# EAGLE design G1000 Arduino Breakout and MCPs (EAGLE 9.6.2)
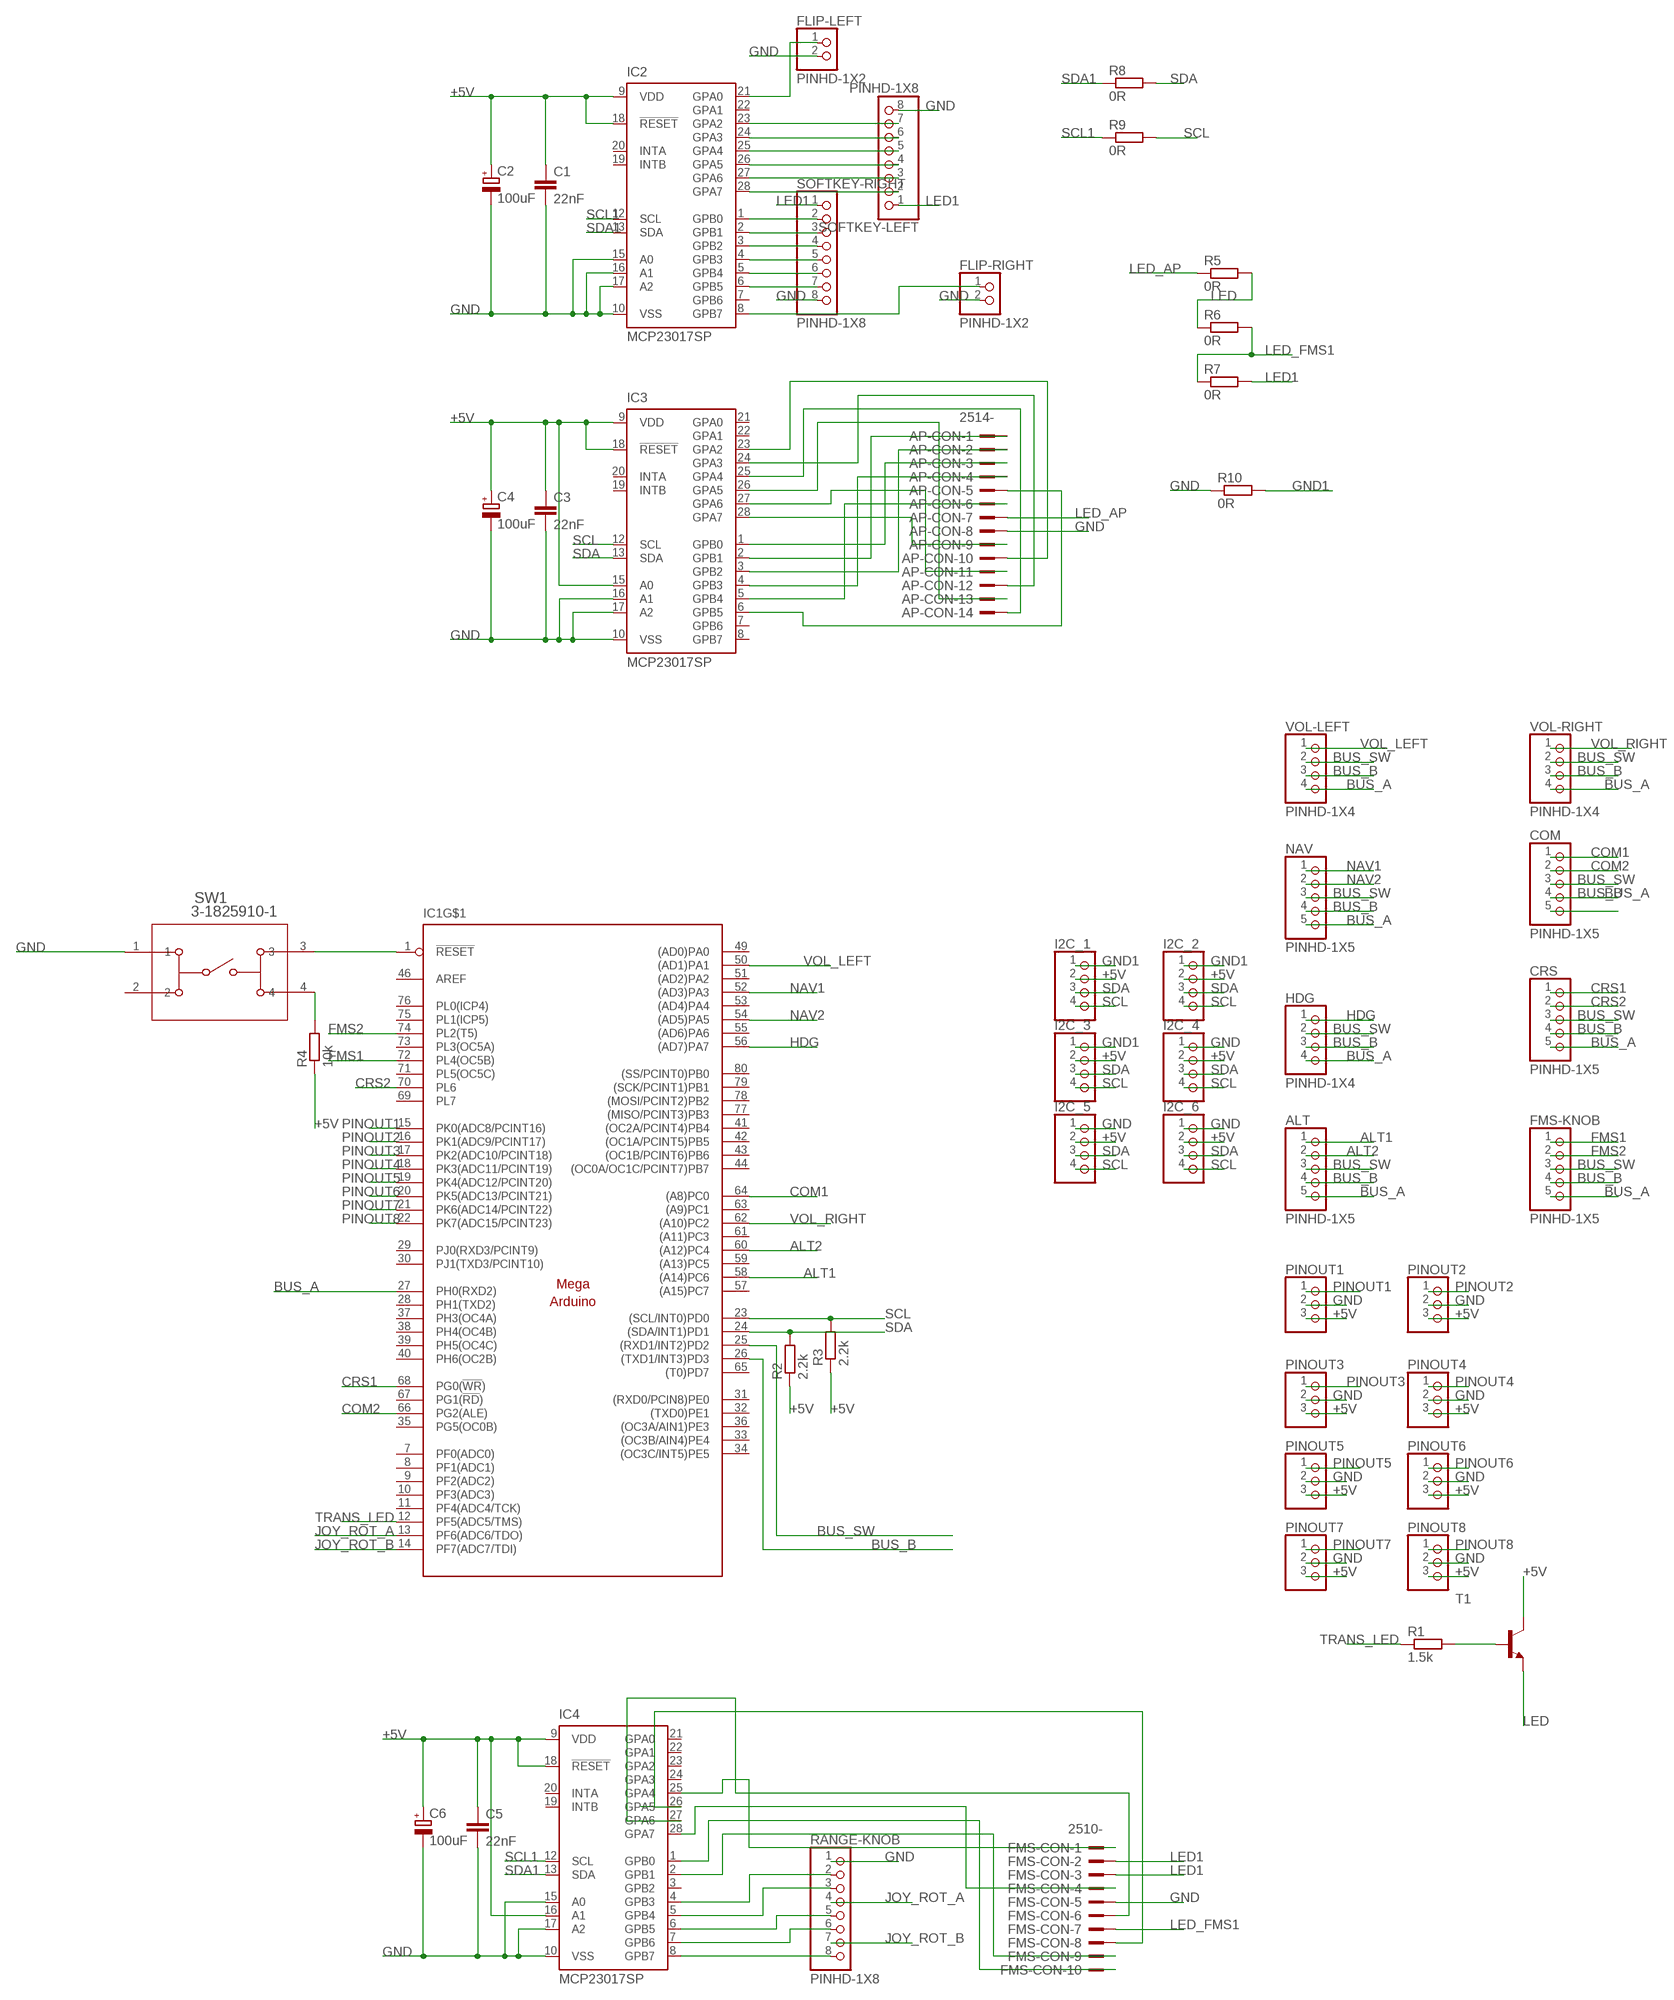
[diagram p0: schematic, sheet 1]

## Parts
ALT  PINHD-1X5  [1X05]
AP-CON  2514-  [PAK100/2500-14]
C1  22nF  C-EU025-025X050  [C025-025X050]
C2  100uF  CPOL-EUE2.5-6  [E2,5-6]
C3  22nF  C-EU025-025X050  [C025-025X050]
C4  100uF  CPOL-EUE2.5-6  [E2,5-6]
C5  22nF  C-EU025-025X050  [C025-025X050]
C6  100uF  CPOL-EUE2.5-6  [E2,5-6]
COM  PINHD-1X5  [1X05]
CRS  PINHD-1X5  [1X05]
FLIP-LEFT  PINHD-1X2  [1X02]
FLIP-RIGHT  PINHD-1X2  [1X02]
FMS-CON  2510-  [PAK100/2500-10]
FMS-KNOB  PINHD-1X5  [1X05]
HDG  PINHD-1X4  [1X04]
I2C_1  PINHD-1X4  [1X04]
I2C_2  PINHD-1X4  [1X04]
I2C_3  PINHD-1X4  [1X04]
I2C_4  PINHD-1X4  [1X04]
I2C_5  PINHD-1X4  [1X04]
I2C_6  PINHD-1X4  [1X04]
IC1  MEGAARDUINO_22  [MEGA_ARDUINO_2]
IC2  MCP23017SP  [DIL28-3]
IC3  MCP23017SP  [DIL28-3]
IC4  MCP23017SP  [DIL28-3]
NAV  PINHD-1X5  [1X05]
PINOUT1  PINHD-1X3  [1X03]
PINOUT2  PINHD-1X3  [1X03]
PINOUT3  PINHD-1X3  [1X03]
PINOUT4  PINHD-1X3  [1X03]
PINOUT5  PINHD-1X3  [1X03]
PINOUT6  PINHD-1X3  [1X03]
PINOUT7  PINHD-1X3  [1X03]
PINOUT8  PINHD-1X3  [1X03]
R1  1.5k  R-EU_0207/10  [0207/10]
R2  2.2k  R-EU_0207/10  [0207/10]
R3  2.2k  R-EU_0207/10  [0207/10]
R4  10k  R-EU_0207/10  [0207/10]
R5  0R  R-EU_0207/10  [0207/10]
R6  0R  R-EU_0207/10  [0207/10]
R7  0R  R-EU_0207/10  [0207/10]
R8  0R  R-EU_0207/10  [0207/10]
R9  0R  R-EU_0207/10  [0207/10]
R10  0R  R-EU_0207/10  [0207/10]
RANGE-KNOB  PINHD-1X8  [1X08]
SOFTKEY-LEFT  PINHD-1X8  [1X08]
SOFTKEY-RIGHT  PINHD-1X8  [1X08]
SW1  3-1825910-1  [SW4_1825910-H]
T1  2N2222-NPN-TO92-EBC  [TO92-EBC]
VOL-LEFT  PINHD-1X4  [1X04]
VOL-RIGHT  PINHD-1X4  [1X04]

## Nets
+5V: C1.1 C2.+ C3.1 C4.+ C5.1 C6.+ I2C_1.2 I2C_2.2 I2C_3.2 I2C_4.2 I2C_5.2 I2C_6.2 IC2.9(VDD) IC2.18(!RESET) IC3.9(VDD) IC3.15(A0) IC3.18(!RESET) IC4.9(VDD) IC4.16(A1) IC4.18(!RESET) PINOUT1.3 PINOUT2.3 PINOUT3.3 PINOUT4.3 PINOUT5.3 PINOUT6.3 PINOUT7.3 PINOUT8.3 R2.1 R3.1 R4.1 T1.C
ALT1: ALT.1 IC1.58((A14)PC6)
ALT2: ALT.2 IC1.60((A12)PC4)
BUS_A: ALT.5 COM.5 CRS.5 FMS-KNOB.5 HDG.4 IC1.27(PH0(RXD2)) NAV.5 VOL-LEFT.4 VOL-RIGHT.4
BUS_B: ALT.4 COM.4 CRS.4 FMS-KNOB.4 HDG.3 IC1.26((TXD1/INT3)PD3) NAV.4 VOL-LEFT.3 VOL-RIGHT.3
BUS_SW: ALT.3 COM.3 CRS.3 FMS-KNOB.3 HDG.2 IC1.25((RXD1/INT2)PD2) NAV.3 VOL-LEFT.2 VOL-RIGHT.2
COM1: COM.1 IC1.64((A8)PC0)
COM2: COM.2 IC1.66(PG2(ALE))
CRS1: CRS.1 IC1.68(PG0(!WR!))
CRS2: CRS.2 IC1.70(PL6)
FMS1: FMS-KNOB.1 IC1.72(PL4(OC5B))
FMS2: FMS-KNOB.2 IC1.74(PL2(T5))
GND: AP-CON.8 C1.2 C2.- C3.2 C4.- C5.2 C6.- FLIP-LEFT.2 FLIP-RIGHT.2 FMS-CON.5 I2C_4.1 I2C_5.1 I2C_6.1 IC2.10(VSS) IC2.15(A0) IC2.16(A1) IC2.17(A2) IC3.10(VSS) IC3.16(A1) IC3.17(A2) IC4.10(VSS) IC4.15(A0) IC4.17(A2) PINOUT1.2 PINOUT2.2 PINOUT3.2 PINOUT4.2 PINOUT5.2 PINOUT6.2 PINOUT7.2 PINOUT8.2 R10.1 RANGE-KNOB.1 SOFTKEY-LEFT.8 SOFTKEY-RIGHT.8 SW1.1
GND1: I2C_1.1 I2C_2.1 I2C_3.1 R10.2
HDG: HDG.1 IC1.56((AD7)PA7)
JOY_ROT_A: IC1.13(PF6(ADC6/TDO)) RANGE-KNOB.4
JOY_ROT_B: IC1.14(PF7(ADC7/TDI)) RANGE-KNOB.7
LED: R5.2 R6.1 T1.E
LED1: FMS-CON.2 FMS-CON.3 R7.2 SOFTKEY-LEFT.1 SOFTKEY-RIGHT.1
LED_AP: AP-CON.7 R5.1
LED_FMS1: FMS-CON.7 R6.2 R7.1
N$1: R1.2 T1.B
N$3: IC2.1(GPB0) SOFTKEY-RIGHT.2
N$4: IC2.2(GPB1) SOFTKEY-RIGHT.3
N$5: IC2.3(GPB2) SOFTKEY-RIGHT.4
N$6: IC2.4(GPB3) SOFTKEY-RIGHT.5
N$7: IC2.5(GPB4) SOFTKEY-RIGHT.6
N$8: IC2.6(GPB5) SOFTKEY-RIGHT.7
N$9: IC2.28(GPA7) SOFTKEY-LEFT.2
N$10: IC2.27(GPA6) SOFTKEY-LEFT.3
N$11: IC2.26(GPA5) SOFTKEY-LEFT.4
N$12: IC2.25(GPA4) SOFTKEY-LEFT.5
N$13: IC2.24(GPA3) SOFTKEY-LEFT.6
N$14: IC2.23(GPA2) SOFTKEY-LEFT.7
N$15: FLIP-LEFT.1 IC2.21(GPA0)
N$16: FLIP-RIGHT.1 IC2.8(GPB7)
N$17: R4.2 SW1.4
N$18: AP-CON.3 IC3.1(GPB0)
N$19: IC1.1(!RESET) SW1.3
N$20: AP-CON.1 IC3.2(GPB1)
N$21: AP-CON.2 IC3.3(GPB2)
N$22: AP-CON.4 IC3.4(GPB3)
N$23: AP-CON.6 IC3.5(GPB4)
N$24: AP-CON.9 IC3.28(GPA7)
N$25: AP-CON.11 IC3.27(GPA6)
N$26: AP-CON.13 IC3.26(GPA5)
N$27: AP-CON.14 IC3.25(GPA4)
N$28: AP-CON.12 IC3.24(GPA3)
N$29: AP-CON.10 IC3.23(GPA2)
N$30: AP-CON.5 IC3.6(GPB5)
N$31: IC4.8(GPB7) RANGE-KNOB.8
N$32: IC4.7(GPB6) RANGE-KNOB.6
N$33: IC4.6(GPB5) RANGE-KNOB.5
N$34: IC4.5(GPB4) RANGE-KNOB.3
N$35: IC4.4(GPB3) RANGE-KNOB.2
N$36: FMS-CON.1 IC4.25(GPA4)
N$37: FMS-CON.9 IC4.2(GPB1)
N$38: FMS-CON.10 IC4.1(GPB0)
N$39: FMS-CON.4 IC4.28(GPA7)
N$40: FMS-CON.6 IC4.27(GPA6)
N$41: FMS-CON.8 IC4.26(GPA5)
NAV1: IC1.52((AD3)PA3) NAV.1
NAV2: IC1.54((AD5)PA5) NAV.2
PINOUT1: IC1.15(PK0(ADC8/PCINT16)) PINOUT1.1
PINOUT2: IC1.16(PK1(ADC9/PCINT17)) PINOUT2.1
PINOUT3: IC1.17(PK2(ADC10/PCINT18)) PINOUT3.1
PINOUT4: IC1.18(PK3(ADC11/PCINT19)) PINOUT4.1
PINOUT5: IC1.19(PK4(ADC12/PCINT20)) PINOUT5.1
PINOUT6: IC1.20(PK5(ADC13/PCINT21)) PINOUT6.1
PINOUT7: IC1.21(PK6(ADC14/PCINT22)) PINOUT7.1
PINOUT8: IC1.22(PK7(ADC15/PCINT23)) PINOUT8.1
SCL: I2C_1.4 I2C_2.4 I2C_3.4 I2C_4.4 I2C_5.4 I2C_6.4 IC1.23((SCL/INT0)PD0) IC3.12(SCL) R3.2 R9.2
SCL1: IC2.12(SCL) IC4.12(SCL) R9.1
SDA: I2C_1.3 I2C_2.3 I2C_3.3 I2C_4.3 I2C_5.3 I2C_6.3 IC1.24((SDA/INT1)PD1) IC3.13(SDA) R2.2 R8.2
SDA1: IC2.13(SDA) IC4.13(SDA) R8.1
TRANS_LED: IC1.12(PF5(ADC5/TMS)) R1.1
VOL_LEFT: IC1.50((AD1)PA1) VOL-LEFT.1
VOL_RIGHT: IC1.62((A10)PC2) VOL-RIGHT.1
Unconnected: IC1.7(PF0(ADC0)) IC1.8(PF1(ADC1)) IC1.9(PF2(ADC2)) IC1.10(PF3(ADC3)) IC1.11(PF4(ADC4/TCK)) IC1.28(PH1(TXD2)) IC1.29(PJ0(RXD3/PCINT9)) IC1.30(PJ1(TXD3/PCINT10)) IC1.31((RXD0/PCIN8)PE0) IC1.32((TXD0)PE1) IC1.33((OC3B/AIN4)PE4) IC1.34((OC3C/INT5)PE5) IC1.35(PG5(OC0B)) IC1.36((OC3A/AIN1)PE3) IC1.37(PH3(OC4A)) IC1.38(PH4(OC4B)) IC1.39(PH5(OC4C)) IC1.40(PH6(OC2B)) IC1.41((OC2A/PCINT4)PB4) IC1.42((OC1A/PCINT5)PB5) IC1.43((OC1B/PCINT6)PB6) IC1.44((OC0A/OC1C/PCINT7)PB7) IC1.46(AREF) IC1.49((AD0)PA0) IC1.51((AD2)PA2) IC1.53((AD4)PA4) IC1.55((AD6)PA6) IC1.57((A15)PC7) IC1.59((A13)PC5) IC1.61((A11)PC3) IC1.63((A9)PC1) IC1.65((T0)PD7) IC1.67(PG1(!RD!)) IC1.69(PL7) IC1.71(PL5(OC5C)) IC1.73(PL3(OC5A)) IC1.75(PL1(ICP5)) IC1.76(PL0(ICP4)) IC1.77((MISO/PCINT3)PB3) IC1.78((MOSI/PCINT2)PB2) IC1.79((SCK/PCINT1)PB1) IC1.80((SS/PCINT0)PB0) IC2.7(GPB6) IC2.19(INTB) IC2.20(INTA) IC2.22(GPA1) IC3.7(GPB6) IC3.8(GPB7) IC3.19(INTB) IC3.20(INTA) IC3.21(GPA0) IC3.22(GPA1) IC4.3(GPB2) IC4.19(INTB) IC4.20(INTA) IC4.21(GPA0) IC4.22(GPA1) IC4.23(GPA2) IC4.24(GPA3) SW1.2

## Power pins joined to a net without a drawn wire
+3V3: IC1.2(+3V3)
+5V: IC1.3(+5V) IC1.47(+5V) IC1.48(+5V)
+VIN: IC1.6(+VIN)
GND: IC1.4(GND) IC1.5(GND) IC1.45(GND) IC1.81(GND) IC1.82(GND)

## Library data of the parts
ALT COM CRS FMS-KNOB NAV = Connector:PINHD-1X5: PIN HEADER; CATEGORY: CONNECTOR; SUB-CATEGORY: PIN-HEADER
AP-CON = con-3m:2514-: 3M (TM) Pak 100 4-Wall Header Source: 3M; OC_FARNELL: unknown; OC_NEWARK: unknown
C1 C3 C5 = rcl:C-EU: CAPACITOR, European symbol; SPICEPREFIX: C
C2 C4 C6 = rcl:CPOL-EU: POLARIZED CAPACITOR, European symbol; SPICEPREFIX: C
FLIP-LEFT FLIP-RIGHT = Connector:PINHD-1X2: PIN HEADER; CATEGORY: CONNECTOR; SUB-CATEGORY: PIN-HEADER
FMS-CON = con-3m:2510-: 3M (TM) Pak 100 4-Wall Header Source: 3M; MF: 3M; MPN: 2510-6002UB; OC_FARNELL: 9838244; OC_NEWARK: 46F4725
HDG VOL-LEFT VOL-RIGHT = Connector:PINHD-1X4: PIN HEADER; CATEGORY: CONNECTOR; SUB-CATEGORY: PIN-HEADER
I2C_1-I2C_6 = pinhead:PINHD-1X4: PIN HEADER
IC1 = arduino-mod for mega:MEGAARDUINO_2: The Arduino Mega is a microcontroller board based on the ATmega1280. - 54 digital input/output pins (of which 14 can be used as PWM outputs) - 16 analog inputs - 4 UARTs (hardware serial ports) - 16 MHz crystal oscillator - USB connection - power jack - ICSP header - reset button It contains everything needed to support the microcontroller; simply connect it to a computer with a USB cable or power it with a AC-to-DC adapter or battery to get started. The Mega is compatible with most shields designed for the Arduino Duemilanove or Diecimila. http://arduino.cc/en/Main/ArduinoBoardMega
IC2-IC4 = adafruit:MCP23017: http://ww1.microchip.com/downloads/en/DeviceDoc/21952a.pdf Source: http://ww1.microchip.com/downloads/en/DeviceDoc/21952a.pdf
PINOUT1-PINOUT8 = pinhead:PINHD-1X3: PIN HEADER
R1-R10 = rcl:R-EU_: RESISTOR, European symbol; SPICEPREFIX: R
RANGE-KNOB SOFTKEY-LEFT SOFTKEY-RIGHT = Connector:PINHD-1X8: PIN HEADER; CATEGORY: CONNECTOR; SUB-CATEGORY: PIN-HEADER
SW1 = Switches:3-1825910-1; BUILT_BY: EMA_UL_Team; CATEGORY: Tactile Switches; CONFIGURATION__POLE-THROW_: Single Pole - Single Throw; COPYRIGHT: Copyright (C) 2016 Accelerated Designs. All rights reserved; DESCRIPTION: FSM16JH=6MM TACT SWITCH, HIGH TEMP; MANUFACTURER_PART_NUMBER: 3-1825910-1; MAX_SWITCHING_CURRENT: -; MAX_SWITCHING_VOLTAGE_AC_: -; PART_STATUS: active; PRODUCT_TYPE: Switch; SERIES: Unknown; SWITCH_TYPE: Tactile Switches; TE_PART_NUMBER: 3-1825910-1; VENDOR: TE Connectivity
T1 = transistor-neu-to92:*-NPN-: NPN Transistror

## Board
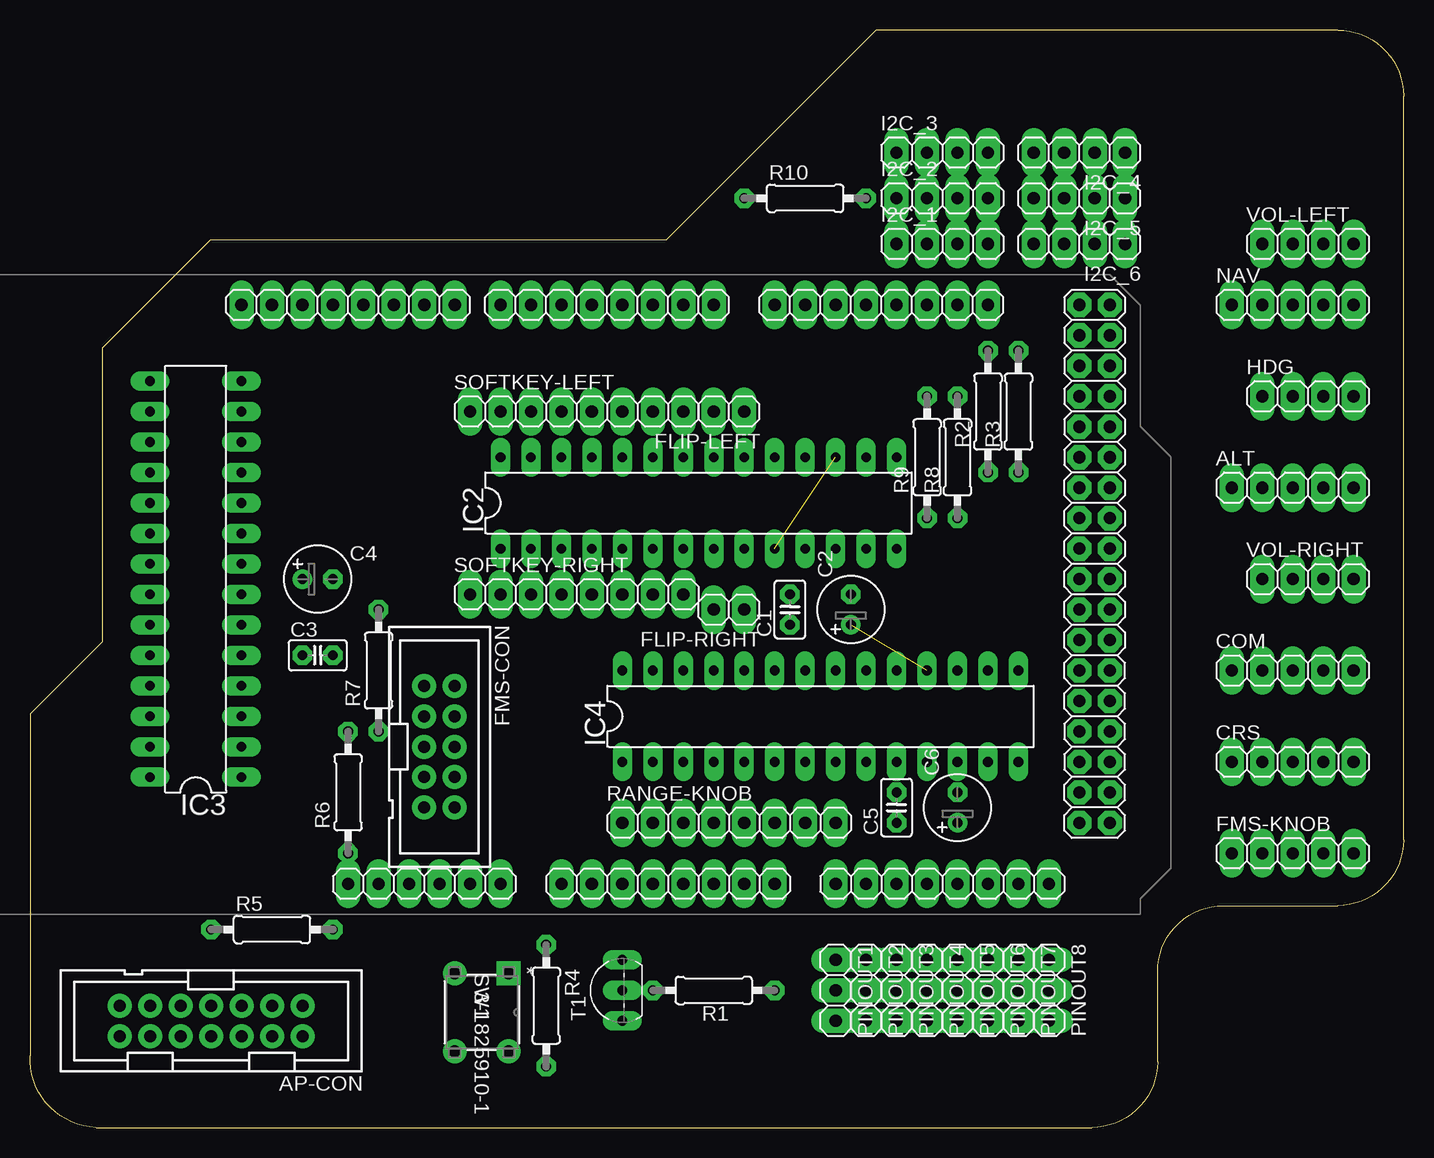
[diagram p1: board, top side]
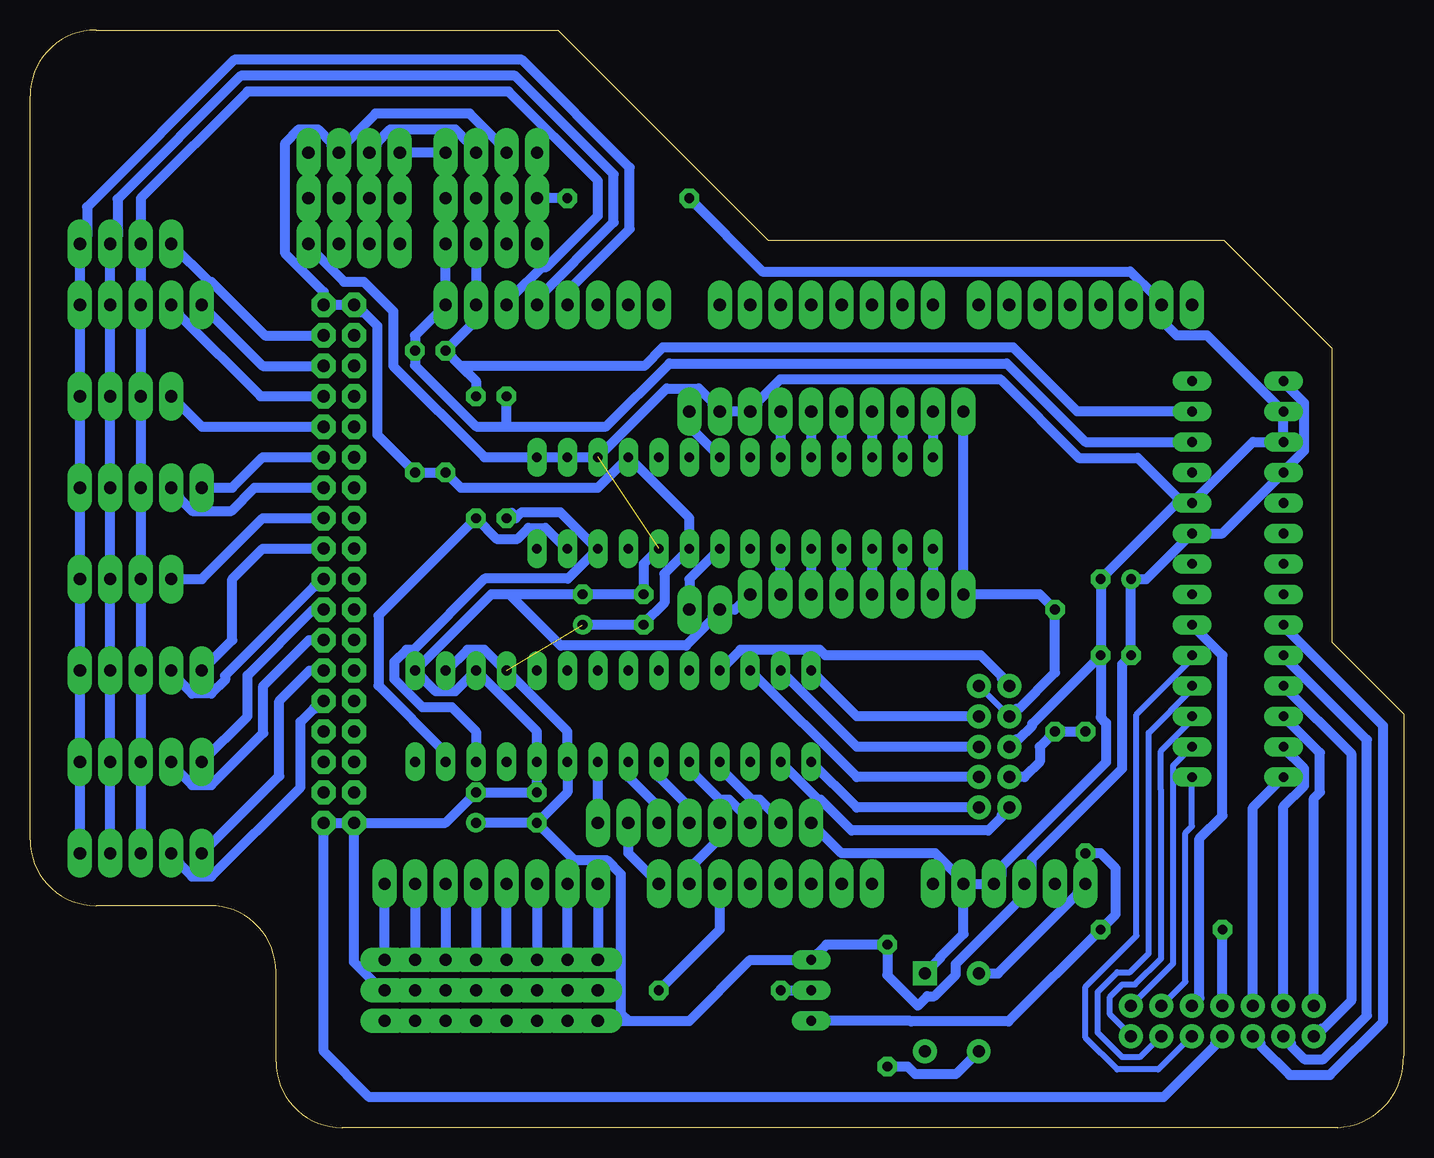
[diagram p2: board, bottom side, seen from below]

Size 114.5 x 91.5 mm. Coordinates in mm from the lower left corner, seen from the top.
Outline: 5.5,0 arc-90 0,6 0,34.5 6,40.5 6,65 15,74 53,74 70.5,91.5 109,91.5 arc-90 114.5,86 114.5,24 arc-90 109,18.5 99.5,18.5 arc90 94,13 94,5.5 arc-90 88.5,0 5.5,0
Copper layers (1*16): Top 0.035mm / dielectric 1.5mm / Bottom 0.035mm
Design rules "swidzi_milling_3018_tht_with_0R_as_via *": minimum track width 20mil, minimum drill 0.8mm, track to track 20mil, track to pad 20mil, pad to pad 20mil, via to via 6mil, smd to smd 6mil, copper to edge 15mil, drill to drill 6mil, minimum pad ring 10mil, minimum via ring 8mil, stop-mask expansion 4mil, vias tented up to drill 0mil, thermal gap 10mil

### Footprints (pad centres in the part's own frame; a part is rotated, then mirrored left to right if it is on the bottom)
1X05 = drill 1.016 long: 1 -5.08,0; 2 -2.54,0; 3 0,0; 4 2.54,0; 5 5.08,0
PAK100/2500-14 = drill 1 pad 1.422: 1 -7.62,-1.27; 2 -7.62,1.27; 3 -5.08,-1.27; 4 -5.08,1.27; 5 -2.54,-1.27; 6 -2.54,1.27; 7 0,-1.27; 8 0,1.27; 9 2.54,-1.27; 10 2.54,1.27; 11 5.08,-1.27; 12 5.08,1.27; 13 7.62,-1.27; 14 7.62,1.27
C025-025X050 = drill 0.813 octagon: 1 -1.27,0; 2 1.27,0
E2,5-6 = drill 0.813 pad 1.6: + -1.27,0 | drill 0.813 pad 1.6 octagon: - 1.27,0
1X02 = drill 1.016 long: 1 -1.27,0; 2 1.27,0
PAK100/2500-10 = drill 1 pad 1.422: 1 -5.08,-1.27; 2 -5.08,1.27; 3 -2.54,-1.27; 4 -2.54,1.27; 5 0,-1.27; 6 0,1.27; 7 2.54,-1.27; 8 2.54,1.27; 9 5.08,-1.27; 10 5.08,1.27
1X04 = drill 1.016 long: 1 -3.81,0; 2 -1.27,0; 3 1.27,0; 4 3.81,0
MEGA_ARDUINO_2 = drill 1.016 long: 1 33.02,2.54; 2 35.56,2.54; 3 38.1,2.54; 4 40.64,2.54; 5 43.18,2.54; 6 45.72,2.54; 7 50.8,2.54; 8 53.34,2.54; 9 55.88,2.54; 10 58.42,2.54; 11 60.96,2.54; 12 63.5,2.54; 13 66.04,2.54; 14 68.58,2.54; 15 73.66,2.54; 16 76.2,2.54; 17 78.74,2.54; 18 81.28,2.54; 19 83.82,2.54; 20 86.36,2.54; 21 88.9,2.54; 22 91.44,2.54; 23 86.36,50.8; 24 83.82,50.8; 25 81.28,50.8; 26 78.74,50.8; 27 76.2,50.8; 28 73.66,50.8; 29 71.12,50.8; 30 68.58,50.8; 31 63.5,50.8; 32 60.96,50.8; 33 58.42,50.8; 34 55.88,50.8; 35 53.34,50.8; 36 50.8,50.8; 37 48.26,50.8; 38 45.72,50.8; 39 41.91,50.8; 40 39.37,50.8; 41 36.83,50.8; 42 34.29,50.8; 43 31.75,50.8; 44 29.21,50.8; 45 26.67,50.8; 46 24.13,50.8 | drill 1.016 octagon: 47 93.98,50.8; 48 96.52,50.8; 49 93.98,48.26; 50 96.52,48.26; 51 93.98,45.72; 52 96.52,45.72; 53 93.98,43.18; 54 96.52,43.18; 55 93.98,40.64; 56 96.52,40.64; 57 93.98,38.1; 58 96.52,38.1; 59 93.98,35.56; 60 96.52,35.56; 61 93.98,33.02; 62 96.52,33.02; 63 93.98,30.48; 64 96.52,30.48; 65 93.98,27.94; 66 96.52,27.94; 67 93.98,25.4; 68 96.52,25.4; 69 93.98,22.86; 70 96.52,22.86; 71 93.98,20.32; 72 96.52,20.32; 73 93.98,17.78; 74 96.52,17.78; 75 93.98,15.24; 76 96.52,15.24; 77 93.98,12.7; 78 96.52,12.7; 79 93.98,10.16; 80 96.52,10.16; 81 93.98,7.62; 82 96.52,7.62
DIL28-3 = drill 0.813 long: 1 -16.51,-3.81; 2 -13.97,-3.81; 3 -11.43,-3.81; 4 -8.89,-3.81; 5 -6.35,-3.81; 6 -3.81,-3.81; 7 -1.27,-3.81; 8 1.27,-3.81; 9 3.81,-3.81; 10 6.35,-3.81; 11 8.89,-3.81; 12 11.43,-3.81; 13 13.97,-3.81; 14 16.51,-3.81; 15 16.51,3.81; 16 13.97,3.81; 17 11.43,3.81; 18 8.89,3.81; 19 6.35,3.81; 20 3.81,3.81; 21 1.27,3.81; 22 -1.27,3.81; 23 -3.81,3.81; 24 -6.35,3.81; 25 -8.89,3.81; 26 -11.43,3.81; 27 -13.97,3.81; 28 -16.51,3.81
1X03 = drill 1.016 long: 1 -2.54,0; 2 0,0; 3 2.54,0
0207/10 = drill 0.813 octagon: 1 -5.08,0; 2 5.08,0
1X08 = drill 1.016 long: 1 -8.89,0; 2 -6.35,0; 3 -3.81,0; 4 -1.27,0; 5 1.27,0; 6 3.81,0; 7 6.35,0; 8 8.89,0
SW4_1825910-H = drill 0.991 pad 1.499 square: 1 -6.502,4.496 | drill 0.991 pad 1.499: 2 0,4.496; 3 -6.502,0; 4 0,0
TO92-EBC = drill 0.813 long: B 0,-1.27; C 2.54,-1.27; E -2.54,-1.27

### Placement (x,y rotation side)
ALT  105.26,53.34 0 top
AP-CON  15.09,8.89 180 top
C1  63.35,43.18 90 top
C2  68.43,43.18 90 top
C3  23.98,39.37 0 top
C4  23.98,45.72 0 top
C5  72.24,26.67 90 top
C6  77.32,26.67 90 top
COM  105.26,38.1 0 top
CRS  105.26,30.48 0 top
FLIP-LEFT  58.27,59.69 180 top
FLIP-RIGHT  58.27,43.18 180 top
FMS-CON  34.14,31.75 270 top
FMS-KNOB  105.26,22.86 0 top
HDG  106.53,60.96 0 top
I2C_1  76.05,73.66 0 top
I2C_2  76.05,77.47 0 top
I2C_3  76.05,81.28 0 top
I2C_4  87.48,81.28 180 top
I2C_5  87.48,77.47 180 top
I2C_6  87.48,73.66 180 top
IC1  -6.5,17.78 0 top
IC2  55.73,52.07 0 top
IC3  13.82,45.72 90 top
IC4  65.89,34.29 0 top
NAV  105.26,68.58 0 top
PINOUT1  67.16,11.43 270 top
PINOUT2  69.7,11.43 270 top
PINOUT3  72.24,11.43 270 top
PINOUT4  74.78,11.43 270 top
PINOUT5  77.32,11.43 270 top
PINOUT6  79.86,11.43 270 top
PINOUT7  82.4,11.43 270 top
PINOUT8  84.94,11.43 270 top
R1  57,11.43 180 top
R2  79.86,59.69 90 top
R3  82.4,59.69 90 top
R4  43.03,10.16 270 top
R5  20.17,16.51 0 top
R6  26.52,27.94 90 top
R7  29.06,38.1 90 top
R8  77.32,55.88 90 top
R9  74.78,55.88 90 top
R10  64.62,77.47 0 top
RANGE-KNOB  58.27,25.4 0 top
SOFTKEY-LEFT  45.57,59.69 0 top
SOFTKEY-RIGHT  45.57,44.45 0 top
SW1  35.41,6.35 270 top
T1  48.11,11.43 90 top
VOL-LEFT  106.53,73.66 0 top
VOL-RIGHT  106.53,45.72 0 top

### Tracks (layer width: path | path; a pad name or v marks a point on that pad's centre or on a via)
+5V  (1 unrouted)
  Bottom 0.813: I2C_4.2 I2C_5.2 I2C_6.2 | I2C_1.2 I2C_2.2 I2C_3.2 75.39,81.89 75.39,82.08 77.84,84.53 85.69,84.53 88.14,82.08 88.14,81.89 I2C_4.2 | I2C_4.2 89.36,81.89 89.36,82.08 90.49,83.21 92.09,83.21 93.22,82.08 93.22,72.86 90.02,69.66 IC1.48 IC1.47 86.87,67.97 86.68,67.97 85.55,66.84 85.55,57.76 R3.1 R2.1 78.59,53.34 67.16,53.34 IC2.18 59.54,50.8 IC2.9 61.62,46.18 61.62,43.73 63.35,42.01 C1.1 C2.+ | PINOUT8.3 PINOUT7.3 PINOUT6.3 PINOUT5.3 PINOUT4.3 PINOUT3.3 PINOUT2.3 PINOUT1.3 64.62,8.89 | 64.62,8.89 59.54,8.89 54.46,13.97 T1.C 48.11,15.24 R4.1 43.03,12.7 40.49,10.16 39.7,10.95 39.12,10.95 37.31,12.75 37.31,13.64 31.6,19.36 IC1.3 30.99,20.93 30.99,22.39 23.47,29.91 23.47,38.61 C3.1 C4.+ 21.44,45.72 IC3.9 15.09,49.53 IC3.18 10.01,54.71 8.28,56.44 8.28,60.41 10.01,62.13 IC3.15 | C5.1 69.7,27.94 IC4.9 69.7,33.02 IC4.18 74.88,38.1 76.61,39.83 78.03,39.83 79.76,38.1 IC4.16 | C5.1 C6.+ | 64.62,8.89 65.23,9.5 65.23,21.12 66.36,22.25 69.09,22.25 C5.1
ALT1
  Bottom 0.813: ALT.1 97.64,53.34 95.1,55.88 IC1.58
ALT2
  Bottom 0.813: IC1.60 95.77,53.34 97.7,51.41 100.98,51.41 102.11,52.54 102.11,52.73 ALT.2
BUS_A
  Bottom 0.813: IC1.27 69.7,69.73 64.52,74.92 64.52,80.02 73.5,89 97.46,89 109.73,76.73 109.73,74.27 VOL-LEFT.4 NAV.5 HDG.4 ALT.5 VOL-RIGHT.4 COM.5 CRS.5 FMS-KNOB.5
BUS_B
  Bottom 0.813: IC1.26 72.24,69.06 65.84,75.46 65.84,79.48 74.04,87.68 96.92,87.68 107.19,77.41 107.19,74.27 VOL-LEFT.3 NAV.4 HDG.3 ALT.4 VOL-RIGHT.3 COM.4 CRS.4 FMS-KNOB.4
BUS_SW
  Bottom 0.813: IC1.25 74.17,69.19 74.17,69.38 71.82,71.73 71.44,71.73 67.16,76.01 67.16,78.93 74.59,86.36 96.37,86.36 105.26,77.47 VOL-LEFT.2 NAV.3 HDG.2 ALT.3 VOL-RIGHT.2 COM.3 CRS.3 FMS-KNOB.3
COM1
  Bottom 0.813: COM.1 97.64,40.64 97.64,45.72 95.1,48.26 IC1.64
COM2
  Bottom 0.813: IC1.66 90.63,45.11 90.82,45.11 98.25,37.68 98.25,37.3 99.38,36.17 100.98,36.17 102.11,37.3 102.11,37.49 COM.2
CRS1
  Bottom 0.813: CRS.1 96.37,34.29 96.37,37.69 90.88,43.18 IC1.68
CRS2
  Bottom 0.813: CRS.2 102.11,29.87 102.11,29.68 100.98,28.55 99.38,28.55 95.05,32.88 95.05,36.83 91.24,40.64 IC1.70
FMS1
  Bottom 0.813: FMS-KNOB.1 93.73,29.31 93.73,35.56 91.19,38.1 IC1.72
FMS2
  Bottom 0.813: IC1.74 90.63,34.95 90.82,34.95 91.95,33.82 91.95,28.36 99.38,20.93 100.98,20.93 102.11,22.06 102.11,22.25 FMS-KNOB.2
GND  (1 unrouted)
  Bottom 0.813: I2C_4.1 I2C_5.1 I2C_6.1 91.29,73.47 88.33,70.51 86.68,70.51 84.23,68.06 84.23,63.5 76.61,55.88 IC2.15 IC2.16 IC2.17 61.42,61.62 58.74,61.62 57.61,60.49 57.61,60.3 FLIP-LEFT.2 SOFTKEY-LEFT.8 53.85,60.3 53.85,60.49 51.96,62.38 33.62,62.38 27.07,55.83 22.15,55.83 18.39,52.07 | IC1.81 IC1.82 90.02,6.35 86.21,2.54 20,2.54 15.72,6.83 15.72,6.99 AP-CON.8 | IC1.81 79.86,25.4 C6.- C5.2 IC4.10 72.24,33.02 IC4.17 79.05,36.37 80.67,36.37 IC4.15 76.05,44.45 74.53,44.45 | IC1.81 87.48,13.78 85.74,12.04 85.55,12.04 PINOUT8.2 PINOUT7.2 PINOUT6.2 PINOUT5.2 PINOUT4.2 PINOUT3.2 PINOUT2.2 PINOUT1.2 | IC1.5 IC1.4 33.53,20.93 33.53,21.72 24.79,30.45 24.79,33.73 25.25,34.19 C3.2 | SW1.1 38.64,14.12 38.64,14.19 36.68,16.14 IC1.5 | IC1.5 37.29,20.93 37.29,21.12 39.03,22.86 46.84,22.86 RANGE-KNOB.1 | SOFTKEY-RIGHT.8 55.73,43.18 FLIP-RIGHT.2 57.61,42.57 57.61,42.38 59.81,40.18 70.26,40.18 74.53,44.45 | IC2.10 63.35,46.99 C1.2 C2.- 74.53,44.45 | C3.2 C4.- 18.9,52.07 18.39,52.07 | FMS-CON.5 32.24,32.38 32.08,32.38 30.96,33.5 30.96,33.66 C3.2 | 18.39,52.07 IC3.10 12.55,57.15 IC3.17 IC3.16 16.36,66.04 18.9,66.04 20.17,67.31 IC1.45 20.78,69.19 20.78,69.38 22.77,71.37 53.44,71.37 R10.1
GND1
  Bottom 0.813: R10.2 I2C_2.1 | I2C_2.1 I2C_3.1 | I2C_2.1 I2C_1.1
HDG
  Bottom 0.813: HDG.1 100.18,58.42 IC1.56
JOY_ROT_A
  Bottom 0.813: IC1.13 59.54,21.59 57,24.13 RANGE-KNOB.4
JOY_ROT_B
  Bottom 0.813: IC1.14 64.62,22.86 RANGE-KNOB.7
LED
  Bottom 0.813: T1.E 41.09,8.89 41.04,8.84 32.92,8.84 R5.2 23.98,17.78 23.98,21.59 25.25,22.86 R6.1
LED1
  Bottom 0.508: FMS-CON.2 FMS-CON.3
  Bottom 0.813: FMS-CON.3 32.24,34.92 32.08,34.92 29.06,37.93 R7.2 30.33,44.45 SOFTKEY-RIGHT.1 SOFTKEY-LEFT.1
LED_AP
  Bottom 0.813: AP-CON.7 R5.1
LED_FMS1
  Bottom 0.813: R6.2 R7.1 30.33,31.75 30.33,30.48 31.6,29.21 FMS-CON.7
N$1
  Bottom 0.813: R1.2 T1.B
N$3
  Bottom 0.813: IC2.1 SOFTKEY-RIGHT.2
N$4
  Bottom 0.813: SOFTKEY-RIGHT.3 IC2.2
N$5
  Bottom 0.813: IC2.3 SOFTKEY-RIGHT.4
N$6
  Bottom 0.813: SOFTKEY-RIGHT.5 IC2.4
N$7
  Bottom 0.813: IC2.5 SOFTKEY-RIGHT.6
N$8
  Bottom 0.813: SOFTKEY-RIGHT.7 IC2.6
N$9
  Bottom 0.813: SOFTKEY-LEFT.2 IC2.28
N$10
  Bottom 0.813: SOFTKEY-LEFT.3 IC2.27
N$11
  Bottom 0.813: SOFTKEY-LEFT.4 IC2.26
N$12
  Bottom 0.813: SOFTKEY-LEFT.5 IC2.25
N$13
  Bottom 0.813: SOFTKEY-LEFT.6 IC2.24
N$14
  Bottom 0.813: SOFTKEY-LEFT.7 IC2.23
N$15
  Bottom 0.813: FLIP-LEFT.1 59.54,58.42 IC2.21
N$16
  Bottom 0.813: IC2.8 59.54,45.72 FLIP-RIGHT.1
N$17
  Bottom 0.813: R4.2 41.33,5.08 40.7,4.45 37.31,4.45 SW1.4
N$18
  Bottom 0.508: AP-CON.3 18.17,12.16 18.17,24.57 17.63,25.11 IC3.1
N$19
  Bottom 0.813: IC1.1 27.13,19.71 27.13,19.52 33.8,12.85 SW1.3
N$20
  Bottom 0.508: AP-CON.1 19.19,13.68 19.19,28.54 19.2,28.56 19.2,30.18 IC3.2
N$21
  Bottom 0.508: AP-CON.2 22.71,7.67 24.47,9.43 24.47,10.89 23.44,11.92 22.39,11.92 20.2,14.1 20.2,28.12 20.22,28.14 20.22,31.39 17.63,33.98 IC3.3
N$22
  Bottom 0.508: AP-CON.4 20.22,7.62 21.98,5.86 23.44,5.86 25.49,7.91 25.49,11.31 23.86,12.94 22.81,12.94 21.24,14.51 21.24,32.91 17.63,36.52 IC3.4
N$23
  Bottom 0.508: IC3.5 17.63,39.06 22.25,34.43 22.25,15.98 26.5,11.73 26.5,7.49 23.86,4.84 20.46,4.84 17.68,7.62 AP-CON.6
N$24
  Bottom 0.813: IC3.28 12.55,26.67 AP-CON.9
N$25
  Bottom 0.813: IC3.27 10.01,31.65 8.28,29.93 8.28,28.5 10.01,26.77 AP-CON.11
N$26
  Bottom 0.813: AP-CON.13 7.47,27.44 6.96,27.95 6.96,31.24 IC3.26
N$27
  Bottom 0.813: 7.47,7.71 AP-CON.14 6.84,8.25 6.68,8.25 4.37,10.55 4.37,31.19 IC3.25
N$28
  Bottom 0.813: AP-CON.12 9.38,6.99 9.38,6.83 8.26,5.71 6.68,5.71 3.05,9.33 3.05,32.31 10.01,39.27 IC3.24
N$29
  Bottom 0.813: AP-CON.10 11.92,6.99 11.92,6.83 9.48,4.38 6.13,4.38 1.69,8.82 1.69,33.49 10.01,41.81 IC3.23
N$30
  Bottom 0.813: AP-CON.5 17,10.79 17,24.08 15.09,26 15.09,39.37 IC3.6
N$31
  Bottom 0.813: RANGE-KNOB.8 IC4.8
N$32
  Bottom 0.813: RANGE-KNOB.6 62.08,26.67 64.62,29.21 IC4.7
N$33
  Bottom 0.813: RANGE-KNOB.5 59.54,26.67 62.08,29.21 IC4.6
N$34
  Bottom 0.813: RANGE-KNOB.3 55.07,26.01 55.07,26.2 56.2,27.33 57,27.33 59.54,29.87 IC4.5
N$35
  Bottom 0.813: RANGE-KNOB.2 52.53,26.01 52.53,26.2 53.66,27.33 54.33,27.33 57,30 IC4.4
N$36
  Bottom 0.813: FMS-CON.1 33.5,37.46 33.5,37.62 35.24,39.37 48.21,39.37 48.66,39.83 55.27,39.83 IC4.25
N$37
  Bottom 0.813: IC4.2 48.77,27.33 48.58,27.33 46.01,24.76 34.62,24.76 33.5,25.88 33.5,26.04 FMS-CON.9
N$38
  Bottom 0.813: FMS-CON.10 45.57,26.67 IC4.1
N$39
  Bottom 0.813: IC4.28 45.57,34.29 FMS-CON.4
N$40
  Bottom 0.813: IC4.27 45.57,31.75 FMS-CON.6
N$41
  Bottom 0.813: FMS-CON.8 45.57,29.21 IC4.26
NAV1
  Bottom 0.813: NAV.1 95.1,63.5 IC1.52
NAV2
  Bottom 0.813: NAV.2 102.11,67.97 102.11,67.78 95.29,60.96 IC1.54
PINOUT1
  Bottom 0.813: IC1.15 PINOUT1.1
PINOUT2
  Bottom 0.813: PINOUT2.1 IC1.16
PINOUT3
  Bottom 0.813: IC1.17 PINOUT3.1
PINOUT4
  Bottom 0.813: PINOUT4.1 IC1.18
PINOUT5
  Bottom 0.813: IC1.19 PINOUT5.1
PINOUT6
  Bottom 0.813: IC1.20 PINOUT6.1
PINOUT7
  Bottom 0.813: IC1.21 PINOUT7.1
PINOUT8
  Bottom 0.813: PINOUT8.1 IC1.22
SCL
  Bottom 0.813: I2C_6.4 I2C_5.4 I2C_4.4 I2C_3.4 I2C_2.4 I2C_1.4 IC1.23 82.4,66.04 R3.2 82.4,63.54 77.3,58.44 74.78,58.44 | 74.78,58.44 66.47,58.44 61.2,63.7 33.07,63.7 26.52,57.15 IC3.12 | 74.78,58.44 R9.2
SCL1
  Bottom 0.813: 74.32,51.26 R9.1 74.01,50.8 73.5,51.31 70.31,51.31 67.26,48.26 IC2.12 69.65,45.77 76.6,45.77 82.54,39.83 83.11,39.83 84.13,38.81 84.13,37.38 81.8,35.05 79.35,35.05 77.32,33.02 IC4.12
SDA
  Bottom 0.813: I2C_6.3 I2C_5.3 I2C_4.3 85.6,81.89 85.6,82.08 84.47,83.21 79.06,83.21 77.93,82.08 77.93,81.89 I2C_3.3 I2C_2.3 I2C_1.3 IC1.24 77.32,67.31 R2.2 78.59,63.5 | IC3.13 27.19,59.69 32.53,65.02 61.75,65.02 63.28,63.5 78.59,63.5 | 78.59,63.5 77.32,62.23 R8.2
SDA1
  Bottom 0.813: IC2.13 69.8,48.26 71.53,49.99 72.95,49.99 73.87,49.07 75.59,49.07 R8.1 85.45,42.67 85.45,36.84 79.86,31.25 IC4.13
TRANS_LED
  Bottom 0.813: R1.1 57,16.51 IC1.12
VOL_LEFT
  Bottom 0.813: VOL-LEFT.1 99.57,70.51 99.38,70.51 94.91,66.04 IC1.50
VOL_RIGHT
  Bottom 0.813: VOL-RIGHT.1 100.18,45.72 95.1,50.8 IC1.62